# Altium schematic sheet LEDArray.SchDoc
size A4; DocumentNumber: 2; SheetNumber: 2; SheetTotal: 3
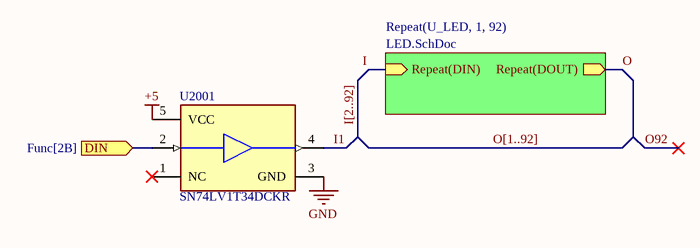
[diagram p0: LEDArray.SchDoc]

## Parts
U2001  SN74LV1T34DCKR  [FP-DCK0005A-IPC_C]

## Sub-sheets
Repeat(U_LED, 1, 92) = LED.SchDoc: Repeat(DOUT) (out), Repeat(DIN) (in)

## Ports
DIN (in, see Func[2B])

## Nets
+5: U2001.5(VCC)
GND: U2001.3(GND)
DIN: U2001.2(A) ; port DIN
I: sheet Repeat(U_LED, 1, 92)/Repeat(DIN)
I1: U2001.4(Y)
O: sheet Repeat(U_LED, 1, 92)/Repeat(DOUT)

Not connected (* = marked no-connect by the designer): U2001 1(NC)*

## Buses and harness runs
bus I[2..92] = O[1..92]

## Library data of the parts
U2001 = CMP-0859-00371-4: IC BUF NON-INVERT 5.5V SC70-5; Number of Outputs: 1; Polarity: Non-Inverting; Quiescent Current: 1uA; High Level Output Current: -8mA; Operating Supply Current: 8mA; Propagation Delay: 15.5ns; Logic Function: Buffer; Min Supply Voltage: 1.6V; Max Operating Temperature: 125°C; Weight: 0.000215oz; Number of Pins: 5; Number of Channels: 1; Mount: Surface Mount; Number of Input Lines: 1; Lead Free: Lead Free; Min Operating Temperature: -40°C; Radiation Hardening: No; Number of Inputs: 1; Number of Elements: 1; REACH SVHC: No SVHC; Packaging: Tape and Reel; Package Quantity: 3000; Case/Package: SC; Number of Bits: 1; Low Level Output Current: 8mA; Max Supply Voltage: 5.5V; Contact Plating: Gold; Number of Bits per Element: 1; Number of Output Lines: 1